# EAGLE design lightbulb-clock (EAGLE 9.6.2)
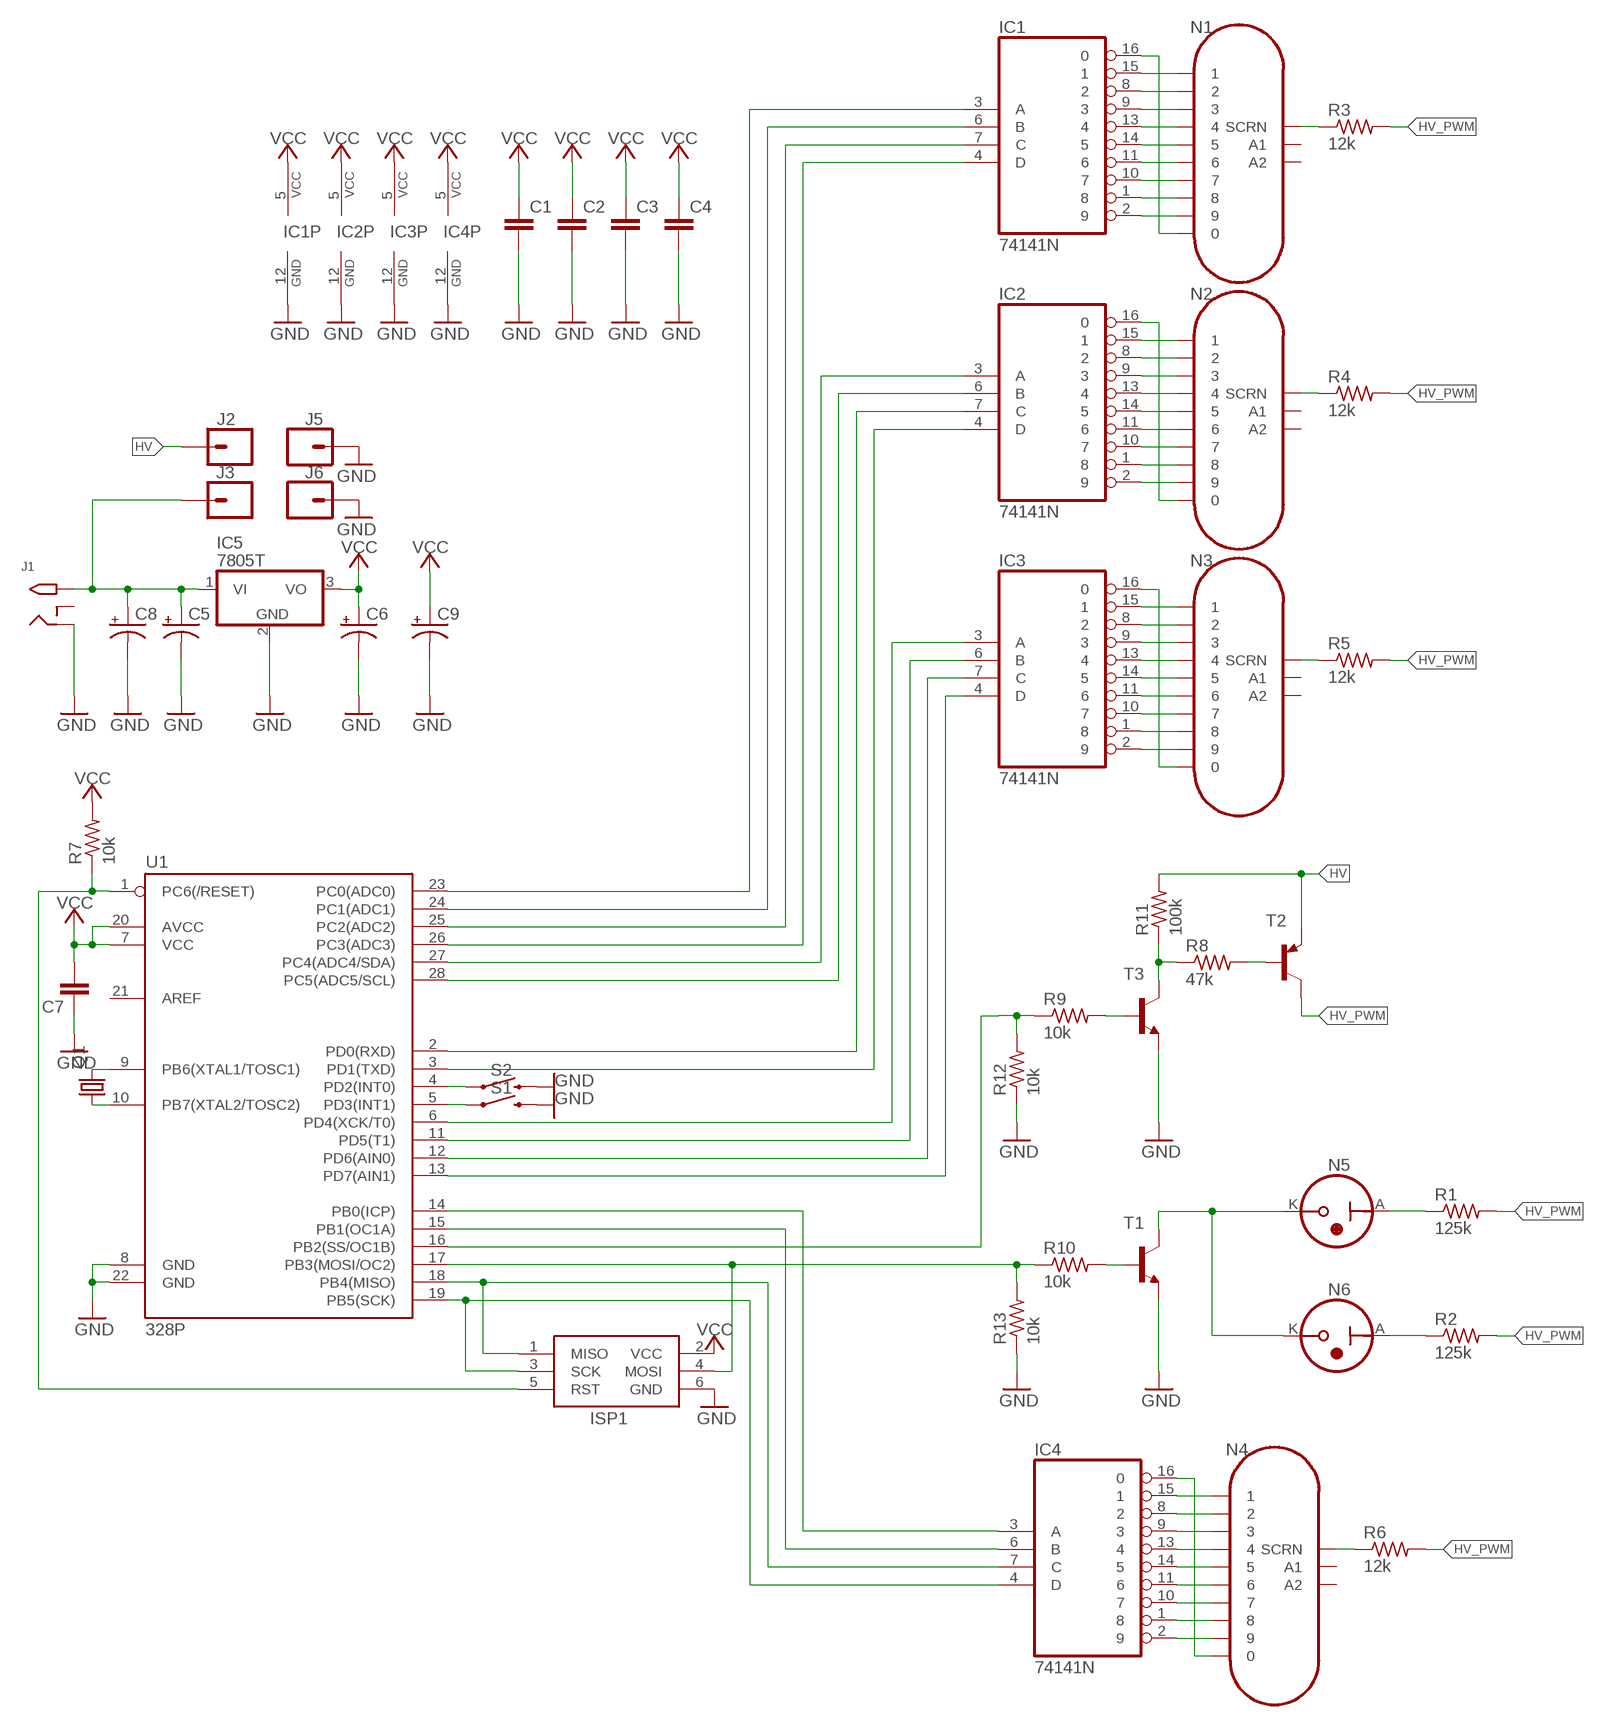
[diagram p0: schematic, sheet 1]

## Parts
C1  C-EU025-024X044  [C025-024X044]
C2  C-EU025-024X044  [C025-024X044]
C3  C-EU025-024X044  [C025-024X044]
C4  C-EU025-024X044  [C025-024X044]
C5  CPOL-USE3.5-8  [E3,5-8]
C6  CPOL-USE3.5-8  [E3,5-8]
C7  C-EU025-024X044  [C025-024X044]
C8  CPOL-USE3.5-8  [E3,5-8]
C9  CPOL-USE3.5-8  [E3,5-8]
IC1  74141N  [DIL16]
IC2  74141N  [DIL16]
IC3  74141N  [DIL16]
IC4  74141N  [DIL16]
IC5  7805T  [TO220H]
ISP1  AVRISP-6  [AVRISP]
J1  2.1MMJACKTHM  [PJ-102A]
J2  CONN_01  [1X01]
J3  CONN_01  [1X01]
J5  CONN_01  [1X01]
J6  CONN_01  [1X01]
N1  IN-4  [IN-4]
N2  IN-4  [IN-4]
N3  IN-4  [IN-4]
N4  IN-4  [IN-4]
N5  INS-1  [INS-1]
N6  INS-1  [INS-1]
Q1  CRYSTALTC26H  [TC26H]
R1  125k  R-US_0204/5  [0204/5]
R2  125k  R-US_0204/5  [0204/5]
R3  12k  R-US_0204/5  [0204/5]
R4  12k  R-US_0204/5  [0204/5]
R5  12k  R-US_0204/5  [0204/5]
R6  12k  R-US_0204/5  [0204/5]
R7  10k  R-US_0204/5  [0204/5]
R8  47k  R-US_0204/5  [0204/5]
R9  10k  R-US_0204/5  [0204/5]
R10  10k  R-US_0204/5  [0204/5]
R11  100k  R-US_0204/5  [0204/5]
R12  10k  R-US_0204/5  [0204/5]
R13  10k  R-US_0204/5  [0204/5]
S1  MOMENTARY-SWITCH-SPST-PTH-6.0MM  [TACTILE_SWITCH_PTH_6.0MM]
S2  MOMENTARY-SWITCH-SPST-PTH-6.0MM  [TACTILE_SWITCH_PTH_6.0MM]
T1  MPSA42-NPN-TO92-EBC  [TO92-EBC]
T2  MPSA92-PNP-TO92-EBC  [TO92-EBC]
T3  MPSA42-NPN-TO92-EBC  [TO92-EBC]
U1  328P  ATMEGA328P_PDIP  [DIP28]

## Nets
GND: C1.2 C2.2 C3.2 C4.2 C5.- C6.- C7.1 C8.- C9.- IC1.12(GND) IC2.12(GND) IC3.12(GND) IC4.12(GND) IC5.2(GND) ISP1.6(GND) J1.RING J5.1 J6.1 R12.1 R13.1 S1.3 S2.3 T1.E T3.E U1.8(GND) U1.22(GND)
HV: J2.1 R11.2 T2.E
HV_PWM [Power]: R1.2 R2.2 R3.2 R4.2 R5.2 R6.2 T2.C
N$1: IC1.1 N1.8
N$2: IC1.2 N1.9
N$3: IC1.8 N1.2
N$4: IC1.9 N1.3
N$5: IC1.10 N1.7
N$6: IC1.11 N1.6
N$7: IC1.13 N1.4
N$8: IC1.14 N1.5
N$9: IC1.15 N1.1
N$10: IC1.16 N1.0
N$11: IC2.1 N2.8
N$12: IC2.2 N2.9
N$13: IC2.8 N2.2
N$14: IC2.9 N2.3
N$15: IC2.10 N2.7
N$16: IC2.11 N2.6
N$17: IC2.13 N2.4
N$18: IC2.14 N2.5
N$19: IC2.15 N2.1
N$20: IC2.16 N2.0
N$21: IC3.1 N3.8
N$22: IC3.2 N3.9
N$23: IC3.8 N3.2
N$24: N1.S(SCRN) R3.1
N$25: IC3.9 N3.3
N$26: N2.S(SCRN) R4.1
N$27: N3.S(SCRN) R5.1
N$28: N4.S(SCRN) R6.1
N$29: N5.A R1.1
N$30: N6.A R2.1
N$31: IC3.10 N3.7
N$32: IC3.11 N3.6
N$33: IC3.13 N3.4
N$34: IC3.14 N3.5
N$35: IC3.15 N3.1
N$36: IC3.16 N3.0
N$37: IC4.1 N4.8
N$38: IC4.2 N4.9
N$39: IC4.8 N4.2
N$40: IC4.9 N4.3
N$41: IC4.10 N4.7
N$42: IC4.11 N4.6
N$43: IC4.13 N4.4
N$44: IC4.14 N4.5
N$45: IC4.15 N4.1
N$46: IC4.16 N4.0
N$47: N5.K N6.K T1.C
N$48: ISP1.4(MOSI) R10.1 R13.2 U1.17(PB3(MOSI/OC2))
N$49: C5.+ C8.+ IC5.1(VI) J1.TIP J3.1
N$50: ISP1.5(RST) R7.1 U1.1(PC6(/RESET))
N$51: IC4.7(C) ISP1.1(MISO) U1.18(PB4(MISO))
N$52: IC4.4(D) ISP1.3(SCK) U1.19(PB5(SCK))
N$53: R8.2 T2.B
N$54: IC3.4(D) U1.13(PD7(AIN1))
N$55: IC4.6(B) U1.15(PB1(OC1A))
N$56: R8.1 R11.1 T3.C
N$57: R9.2 T3.B
N$58: R9.1 R12.2 U1.16(PB2(SS/OC1B))
N$59: R10.2 T1.B
N$60: IC4.3(A) U1.14(PB0(ICP))
N$61: IC3.7(C) U1.12(PD6(AIN0))
N$62: IC3.6(B) U1.11(PD5(T1))
N$63: IC3.3(A) U1.6(PD4(XCK/T0))
N$64: IC2.4(D) U1.3(PD1(TXD))
N$65: IC2.7(C) U1.2(PD0(RXD))
N$66: IC2.6(B) U1.28(PC5(ADC5/SCL))
N$67: S2.1 U1.4(PD2(INT0))
N$68: Q1.2 U1.9(PB6(XTAL1/TOSC1))
N$69: Q1.1 U1.10(PB7(XTAL2/TOSC2))
N$70: S1.1 U1.5(PD3(INT1))
N$71: IC2.3(A) U1.27(PC4(ADC4/SDA))
N$72: IC1.4(D) U1.26(PC3(ADC3))
N$73: IC1.7(C) U1.25(PC2(ADC2))
N$74: IC1.6(B) U1.24(PC1(ADC1))
N$75: IC1.3(A) U1.23(PC0(ADC0))
VCC: C1.1 C2.1 C3.1 C4.1 C6.+ C7.2 C9.+ IC1.5(VCC) IC2.5(VCC) IC3.5(VCC) IC4.5(VCC) IC5.3(VO) ISP1.2(VCC) R7.2 U1.7(VCC) U1.20(AVCC)
Unconnected: J1.RING_SW N1.A1 N1.A2 N2.A1 N2.A2 N3.A1 N3.A2 N4.A1 N4.A2 U1.21(AREF)

## Library data of the parts
C1-C4 C7 = rcl:C-EU: CAPACITOR, European symbol; SPICEPREFIX: C
C5 C6 C8 C9 = rcl:CPOL-US: POLARIZED CAPACITOR, American symbol; SPICEPREFIX: C
IC1-IC4 = 74xx-us:74*141: BCD to decimal DECODER/DRIVER
IC5 = adafruit:78*: Positive VOLTAGE REGULATOR Added bigger pads to the TO-92 package
ISP1 = adafruit:AVRISP: AVR ISP HEADER Standard 6 pin header for AVR programming
J1 = adafruit:2.1MMJACK: 2.1mm x 5.5mm THM DC jack with internal switch. Digikey part #PJ-102A, 4UCON part #05537 2.1mm x 5.5mm SMT DC jack with internal switch. Digikey part #PJ-002A-SMT, 4UCON part #03267 By microbuilder.eu & adafruit.com
J2 J3 J5 J6 = SparkFun-Connectors:CONN_01: Single connection point. Often used as Generic Header-pin footprint for 0.1 inch spaced/style header connections On any of the 0.1 inch spaced packages, you can populate with these: Break Away Headers - Straight <https://www.sparkfun.com/products/116> (PRT-00116) Break Away Male Headers - Right Angle <https://www.sparkfun.com/products/553> (PRT-00553) Female Headers <https://www.sparkfun.com/products/115> (PRT-00115) Break Away Headers - Machine Pin <https://www.sparkfun.com/products/117> (PRT-00117) Break Away Female Headers - Swiss Machine Pin <https://www.sparkfun.com/products/743> (PRT-00743) This device is also useful as a general connection point to wire up your design to another part of your project. Our various solder wires solder well into these plated through hole pads. Hook-Up Wire - Assortment (Stranded, 22 AWG) <https://www.sparkfun.com/products/11375> (PRT-11375) Hook-Up Wire - Assortment (Solid Core, 22 AWG) <https://www.sparkfun.com/products/11367> (PRT-11367) View the entire wire category on our website here <https://www.sparkfun.com/categories/141> Special notes: SMTSO-256-ET is a "flush mount" nut for a 4-40 screw. We mostly use this on specialty testbeds; it is a nice way to connect hardware to your PCB at an adjustable hieght. Also note, the SNAP packages are for using a snappable style connector. We sell a baggie of snaps and they are also used on two LilyPad designs: Snap Assortment - 30 pack (male and female) <https://www.sparkfun.com/products/11347> (DEV-11347) LilyPad Arduino SimpleSnap <https://www.sparkfun.com/products/10941> (DEV-10941) LilyPad SimpleSnap Protoboard <https://www.sparkfun.com/products/10940> (DEV-10940)
N1-N4 = russian-nixies:IN-4: IN-4: large numeric topview nixie tube
N5 N6 = russian-nixies:INS-1
Q1 = adafruit:CRYSTAL: CRYSTAL; OC_FARNELL: unknown; OC_NEWARK: unknown
R1-R13 = rcl:R-US_: RESISTOR, American symbol; SPICEPREFIX: R
S1 S2 = SparkFun-Switches:MOMENTARY-SWITCH-SPST: Momentary Switch (Pushbutton) - SPST Normally-open (NO) SPST momentary switches (buttons, pushbuttons). Variants PTH-12MM - 12mm square, through-hole Momentary Pushbutton Switch - 12mm Square <https://www.sparkfun.com/products/9190> (COM-09190) PTH-6.0MM, PTH-6.0MM-KIT - 6.0mm square, through-hole Mini Pushbutton Switch <https://www.sparkfun.com/products/97> (COM-00097) KIT package intended for soldering kit's - only one side of pads' copper is exposed. PTH-RIGHT-ANGLE-KIT - Right-angle, through-hole Right Angle Tactile Button <https://www.sparkfun.com/products/10791> - Used on SparkFun BigTime Watch Kit <https://www.sparkfun.com/products/11734> SMD-12MM - 12mm square, surface-mount Tactile Button - SMD (12mm) <https://www.sparkfun.com/products/12993> (COM-12993) Used on SparkFun PicoBoard <https://www.sparkfun.com/products/11888> SMD-4.5MM - 4.5mm Square Trackball Switch Used on SparkFun Blackberry Trackballer Breakout <https://www.sparkfun.com/products/13169> SMD-4.6MMX2.8MM - 4.60mm x 2.80mm, surface mount Used on SparkFun SAMD21 Mini Breakout <https://www.sparkfun.com/products/13664> SMD-5.2MM, SMD-5.2-REDUNDANT - 5.2mm square, surface-mount Mini Pushbutton Switch - SMD <https://www.sparkfun.com/products/8720> (COM-08720) Used on Arduino Pro Mini <https://www.sparkfun.com/products/11114> REDUNDANT package connects both switch circuits together SMD-6.0X3.5MM - 6.0 x 3.5mm, surface mount Momentary Reset Switch SMD <https://www.sparkfun.com/products/8229> (COM-08229) SMD-6.2MM-TALL - 6.2mm square, surface mount Tactile Button - SMD (6mm) <https://www.sparkfun.com/products/12992> Used on SparkFun Digital Sandbox <https://www.sparkfun.com/products/12651> SMD-RIGHT-ANGLE - Right-angle, surface mount Used on SparkFun Block for Intel® Edison - Arduino <https://www.sparkfun.com/products/13036>; PROD_ID: SWCH-08441; SF_SKU: COM-00097
T1 T3 = transistor:*-NPN-: NPN Transistror BF959 corrected 2008.03.06
T2 = transistor:*-PNP-: PNP Transistror
U1 = SparkFun-IC-Microcontroller:ATMEGA328P_PDIP: Atmel 328P Through hole ATMEGA328P uC used in the Arduino 32kb flash, 1k EEPROM, 2k SRAM Datasheet <http://www.sparkfun.com/datasheets/Components/SMD/ATMega328.pdf> SparkFun Products Storefront component: AVR 28 Pin 20MHz 32K 6A/D - ATMega328P <https://www.sparkfun.com/products/9061> (COM-09061) SparkFun Simon Says - Through-Hole Soldering Kit <https://www.sparkfun.com/products/10547> (KIT-10547) SparkFun Learn to Solder - Simon Says <https://www.sparkfun.com/products/13708> (KIT-13708) SparkFun BigTime Watch Kit <https://www.sparkfun.com/products/11734> (KIT-11734) SparkFun ClockIt <https://www.sparkfun.com/products/10930> (KIT-10930) SparkFun Serial Enabled LCD Kit <https://www.sparkfun.com/products/10097> (LCD-10097) SparkFun Simon Tilts - Through Hole Soldering Kit <https://www.sparkfun.com/products/12634> (KIT-12634) SparkFun Frequency Counter Kit <https://www.sparkfun.com/products/10140> (KIT-10140) FabFM Radio Kit <https://www.sparkfun.com/products/11043> (KIT-11043) SparkFun Binary Blaster Kit <https://www.sparkfun.com/products/12037> (KIT-12037) SparkFun Metro-Gnome <https://www.sparkfun.com/products/9236> (KIT-09236) ATmega328 with Arduino Optiboot (Uno) <https://www.sparkfun.com/products/10524> (DEV-10524); PROD_ID: IC-09136

## Net classes
1 Power: width 0.254 mm, clearance 0.203 mm

## Board
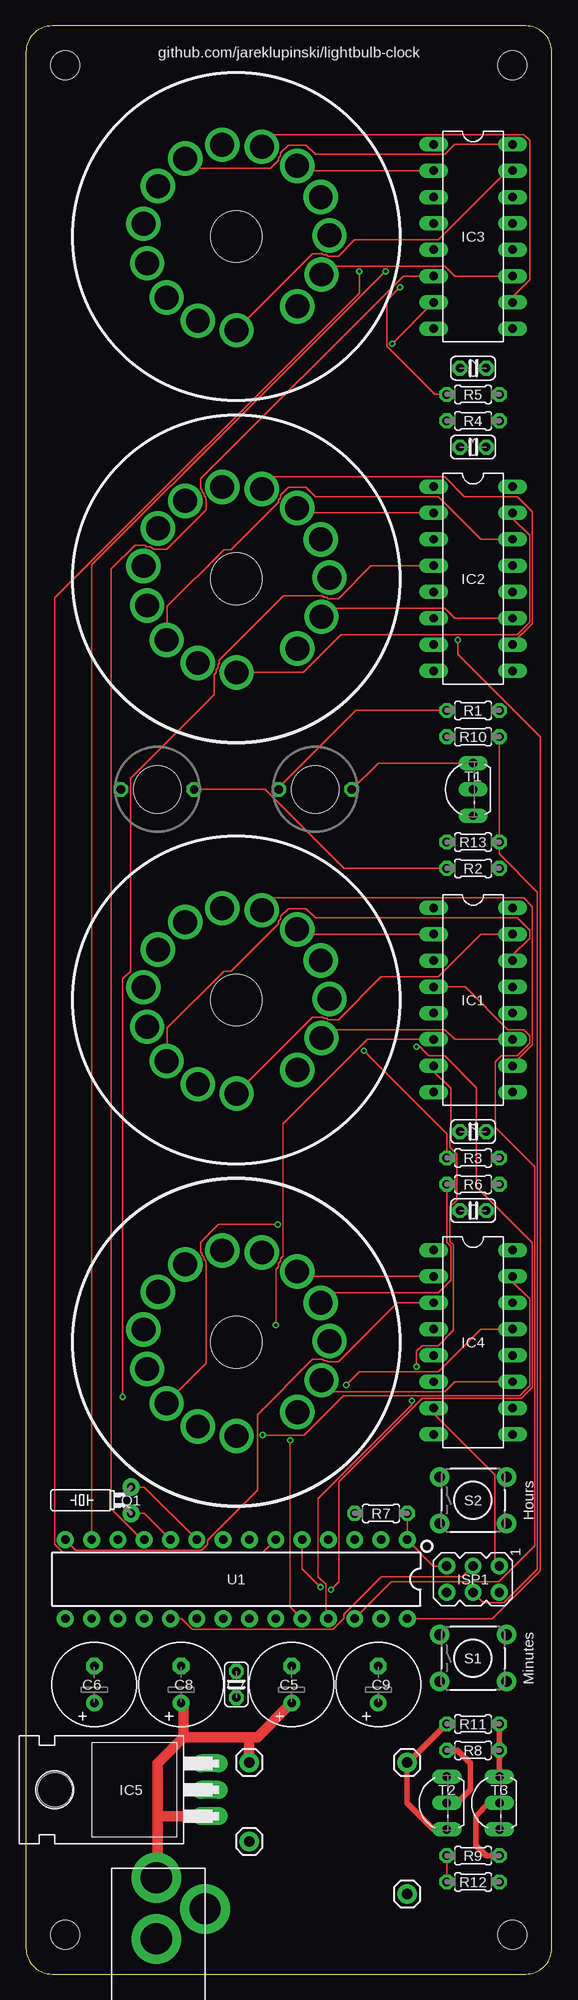
[diagram p1: board, top side]
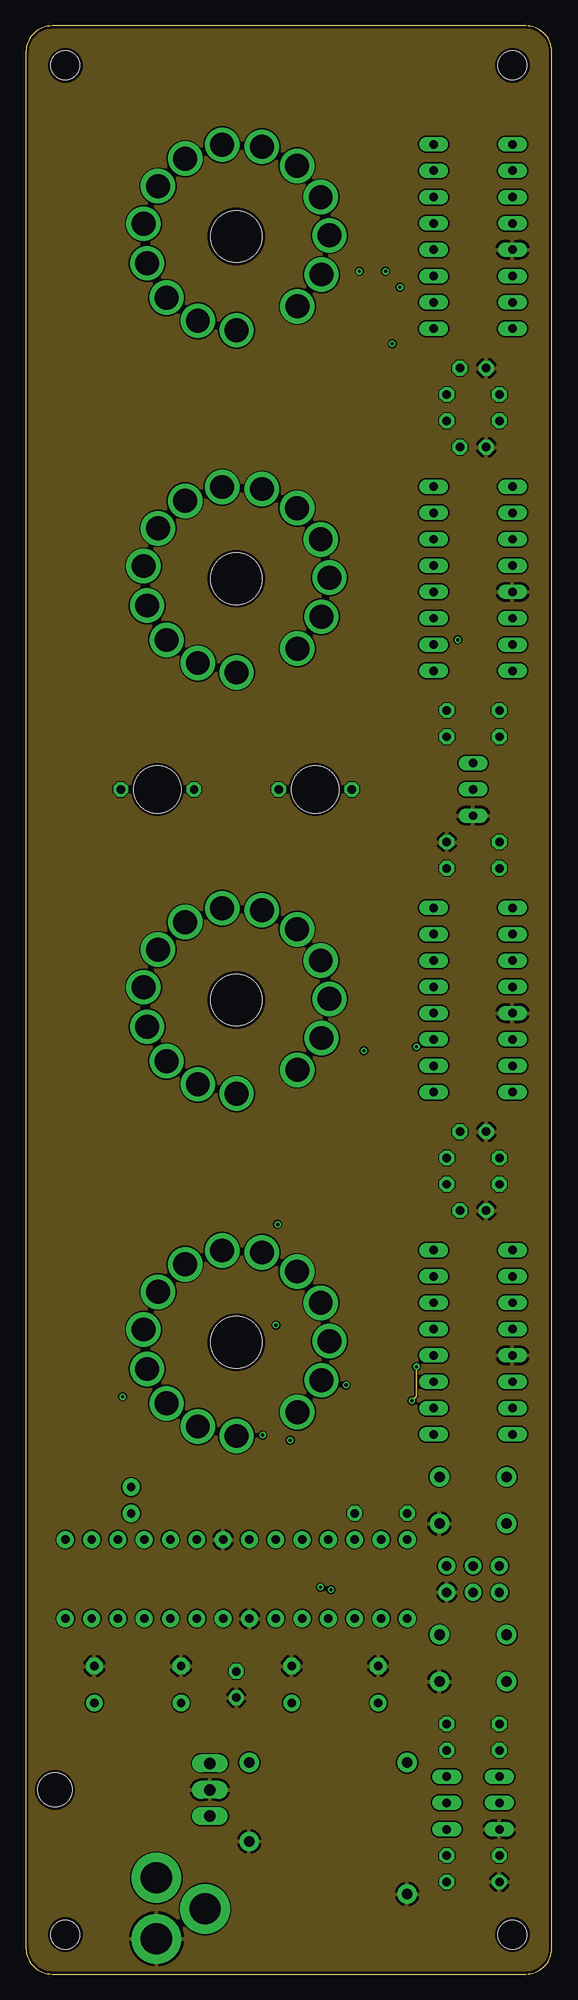
[diagram p2: board, inner layer Route2]
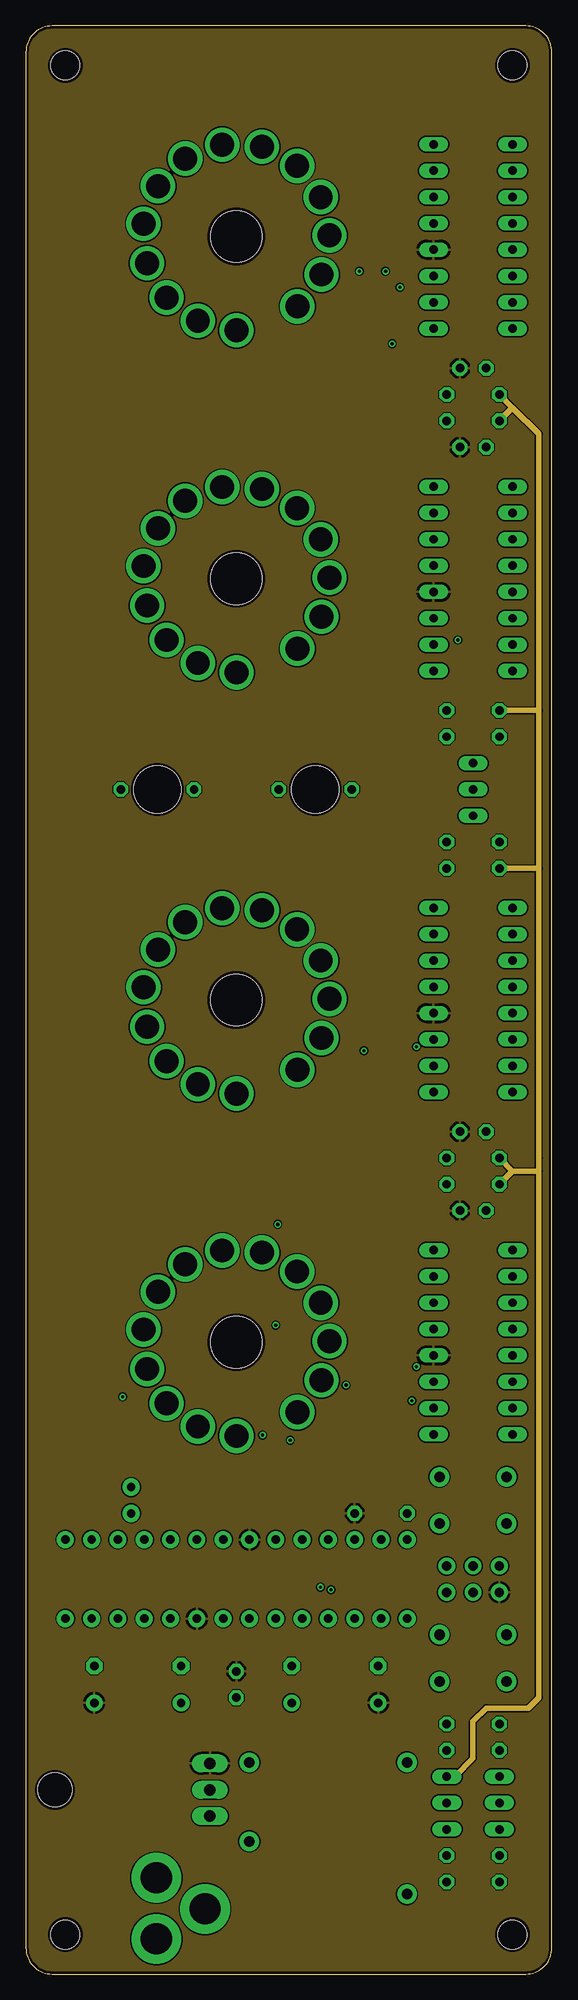
[diagram p3: board, inner layer Route15]
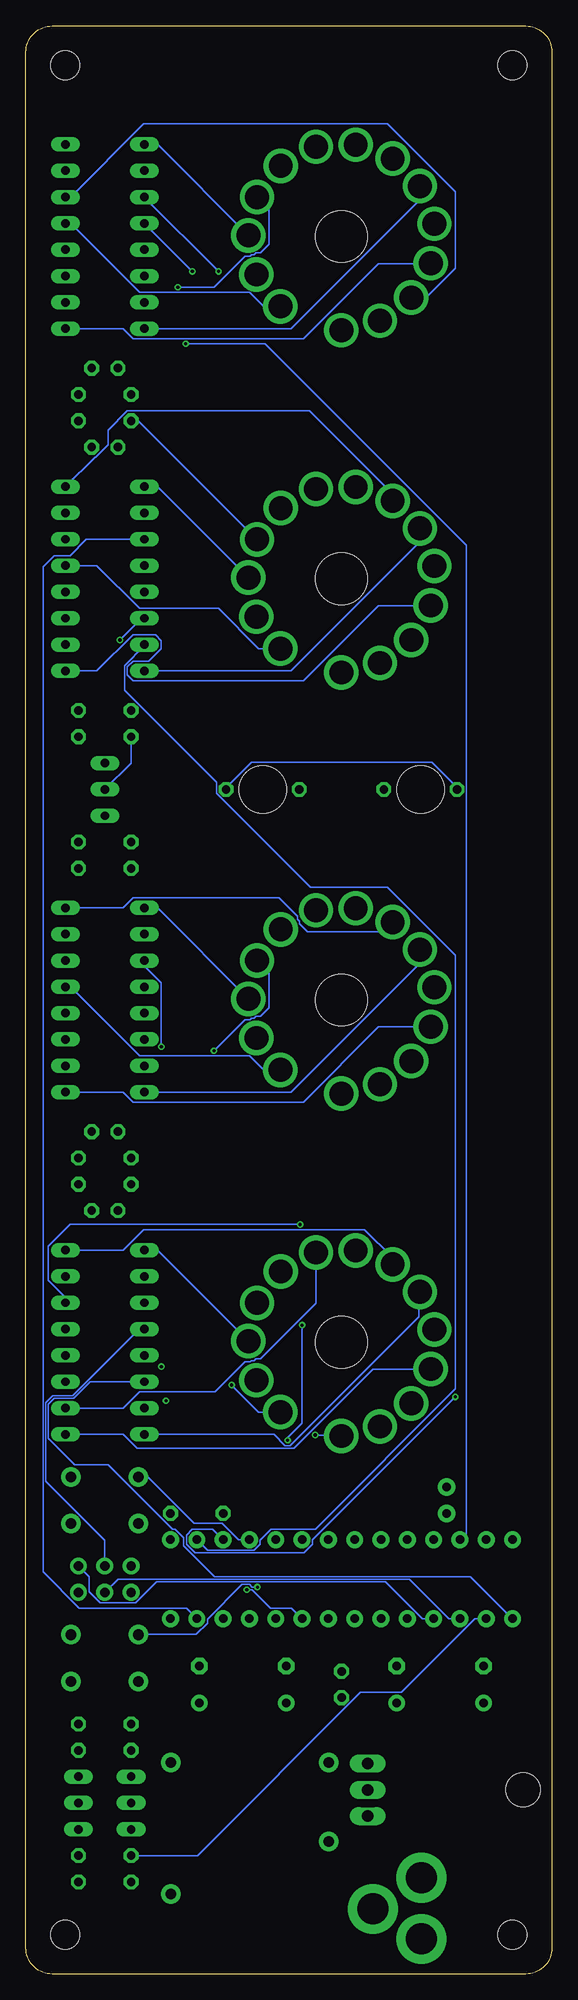
[diagram p4: board, bottom side, seen from below]

Size 50.8 x 187.96 mm. Coordinates in mm from the lower left corner, seen from the top.
Outline: 2.54,0 48.26,0 arc90 50.8,2.54 50.8,185.42 arc90 48.26,187.96 2.54,187.96 arc90 0,185.42 0,2.54 arc90 2.54,0
Copper layers (1*2*15*16): Top 0.035mm / dielectric 0.23mm / Route2 0.035mm / dielectric 0.93mm / Route15 0.035mm / dielectric 0.23mm / Bottom 0.035mm
Design rules "MF_Standard_4_Layer *": minimum track width 5mil, minimum drill 12mil, track to track 5mil, track to pad 5mil, pad to pad 5mil, via to via 5mil, smd to smd 0mil, copper to edge 10mil, drill to drill 10mil, minimum pad ring 12mil, minimum via ring 6mil, stop-mask expansion 2mil, vias tented up to drill 25mil, thermal gap 10mil
Holes 2.79 mm at 46.99,184.15 3.81,184.15 3.81,3.81 46.99,3.81

### Footprints (pad centres in the part's own frame; a part is rotated, then mirrored left to right if it is on the bottom)
C025-024X044 = drill 0.813 octagon: 1 -1.27,0; 2 1.27,0
E3,5-8 = drill 0.813 pad 1.6: + -1.778,0 | drill 0.813 pad 1.6 octagon: - 1.778,0
DIL16 = drill 0.813 long: 1 -8.89,-3.81; 2 -6.35,-3.81; 3 -3.81,-3.81; 4 -1.27,-3.81; 5 1.27,-3.81; 6 3.81,-3.81; 7 6.35,-3.81; 8 8.89,-3.81; 9 8.89,3.81; 10 6.35,3.81; 11 3.81,3.81; 12 1.27,3.81; 13 -1.27,3.81; 14 -3.81,3.81; 15 -6.35,3.81; 16 -8.89,3.81
TO220H = drill 1.118 long: 1 -2.54,-10.16; 2 0,-10.16; 3 2.54,-10.16 | hole 3.302: 0,4.826
AVRISP = drill 0.9 pad 1.626: 1 -1.27,2.54; 2 1.27,2.54; 3 -1.27,0; 4 1.27,0; 5 -1.27,-2.54; 6 1.27,-2.54
PJ-102A = drill 3 pad 4.8: RING 0.1,-3.39; RING_SW -4.6,-6.29; TIP 0.1,-9.29
1X01 = drill 1.016 pad 1.88: 1 0,0
IN-4 = drill 2.3 pad 3.2: 0 -4.939,7.517; 1 0.021,-9.038; 2 -7.562,4.859; 3 -8.616,-2.583; 4 5.9,-6.738; 5 -6.738,-5.9; 6 8.221,-3.669; 7 2.473,8.656; 8 8.995,0.112; 9 5.868,6.819; A1 -3.712,-8.13; A2 -8.959,1.229; NC -1.369,8.851; S 8.157,3.804 | hole 5: 0,0
INS-1 = drill 0.8 octagon: A -3.535,0; K 3.535,0 | hole 4.572: 0,0
TC26H = drill 0.813 pad 1.676: 1 -1.27,0; 2 1.27,0
0204/5 = drill 0.813 octagon: 1 -2.54,0; 2 2.54,0
TACTILE_SWITCH_PTH_6.0MM = drill 1.016 pad 1.88: 1 -3.251,2.261; 2 3.251,2.261; 3 -3.251,-2.261; 4 3.251,-2.261
TO92-EBC = drill 0.813 long: B 0,-1.27; C 2.54,-1.27; E -2.54,-1.27
DIP28 = drill 0.813 pad 1.626: 1 -16.51,-3.81; 2 -13.97,-3.81; 3 -11.43,-3.81; 4 -8.89,-3.81; 5 -6.35,-3.81; 6 -3.81,-3.81; 7 -1.27,-3.81; 8 1.27,-3.81; 9 3.81,-3.81; 10 6.35,-3.81; 11 8.89,-3.81; 12 11.43,-3.81; 13 13.97,-3.81; 14 16.51,-3.81; 15 16.51,3.81; 16 13.97,3.81; 17 11.43,3.81; 18 8.89,3.81; 19 6.35,3.81; 20 3.81,3.81; 21 1.27,3.81; 22 -1.27,3.81; 23 -3.81,3.81; 24 -6.35,3.81; 25 -8.89,3.81; 26 -11.43,3.81; 27 -13.97,3.81; 28 -16.51,3.81

### Placement (x,y rotation side)
C1  43.18,73.66 0 top
C2  43.18,154.94 0 top
C3  43.18,147.32 0 top
C4  43.18,81.28 0 top
C5  25.65,27.94 90 top
C6  6.6,27.94 90 top
C7  20.32,27.94 90 top
C8  14.99,27.94 90 top
C9  34.04,27.94 90 top
IC1  43.18,93.98 270 top
IC2  43.18,134.62 270 top
IC3  43.18,167.64 270 top
IC4  43.18,60.96 270 top
IC5  7.62,17.78 90 top
ISP1  43.18,38.1 270 top
J1  12.7,0 180 top
J2  36.81,20.42 0 top
J3  21.57,20.42 0 top
J5  36.81,7.72 0 top
J6  21.57,12.8 0 top
N1  20.32,93.98 0 top
N2  20.32,134.62 0 top
N3  20.32,167.64 0 top
N4  20.32,60.96 0 top
N5  27.94,114.3 0 top
N6  12.7,114.3 180 top
Q1  10.16,45.72 90 top
R1  43.18,121.92 0 top
R2  43.18,106.68 0 top
R3  43.18,78.74 0 top
R4  43.18,149.86 0 top
R5  43.18,152.4 0 top
R6  43.18,76.2 0 top
R7  34.29,44.45 180 top
R8  43.18,21.59 180 top
R9  43.18,11.43 0 top
R10  43.18,119.38 180 top
R11  43.18,24.13 180 top
R12  43.18,8.89 180 top
R13  43.18,109.22 0 top
S1  43.18,30.48 0 top
S2  43.18,45.72 0 top
T1  41.91,114.3 90 top
T2  39.37,16.51 90 top
T3  44.45,16.51 90 top
U1  20.32,38.1 180 top

### Tracks (layer width: path | path; a pad name or v marks a point on that pad's centre or on a via)
GND
  pour Route2 (isolate 0.13): 50.8,0 50.8,187.96 0,187.96 0,0
HV
  Top 0.508: R11.2 36.93,20.42 J2.1 36.81,16.53 39.37,13.97 T2.E
HV_PWM
  Route15 0.508: 49.53,77.47 49.53,78.74 49.53,106.68 | 49.53,106.68 49.53,121.92 | 49.53,121.92 49.53,148.59 46.99,151.13 | 46.99,151.13 R5.2 | R4.2 46.99,151.13 | R1.2 49.53,121.92 | R2.2 49.53,106.68 | R3.2 46.99,77.47 | 46.99,77.47 49.53,77.47 | R6.2 46.99,77.47 | T2.C 41.4,19.05 43.18,20.83 43.18,24.38 44.45,25.65 48.51,25.65 49.53,26.67 49.53,77.47
N$1
  Bottom 0.127: IC1.1 38.1,102.87 29.34,94.11 N1.8
N$2
  Top 0.127: IC1.2 26.67,100.33 26.23,100.78 N1.9
N$3
  Bottom 0.127: IC1.8 25.21,85.09 12.76,97.54 12.76,98.81 N1.2
N$4
  Bottom 0.127: IC1.9 41.4,85.09 40.45,84.14 24,84.14 16.76,91.38 11.75,91.38 N1.3
N$5
  Top 0.127: IC1.10 46.99,87.76 48.9,89.66 48.9,103 48.07,103.82 23.94,103.82 22.8,102.68 N1.7
N$6
  Top 0.127: IC1.11 41.4,90.17 40.45,91.12 29.34,91.12 28.57,90.36 N1.6
N$7
  Bottom 0.127: IC1.13 46.48,95.25 39.81,88.58 29.21,88.58 27.88,87.25 N1.4
N$8
  Top 0.127: IC1.14 46.99,98.3 48.64,99.95 48.64,100.71 47.43,101.92 27.94,101.92 27.05,102.81 25.34,102.81 24.57,102.04 24.57,101.79 24.38,101.6 24.38,101.35 19.81,96.77 19.11,96.77 13.65,91.31 13.65,88.2 13.59,88.14 N1.5
N$9
  Top 0.127: IC1.15 43.94,100.33 39.81,96.2 34.29,96.2 30.16,92.08 29.15,92.08 29.02,92.2 28.77,92.2 28.64,92.33 27.69,92.33 20.32,84.96 N1.1
N$10
  Bottom 0.127: IC1.16 41.4,102.87 40.45,103.82 26.35,103.82 24.57,102.04 24.57,101.79 24.38,101.6 24.38,101.35 23.62,100.58 16.32,100.58 15.43,101.47 N1.0
N$11
  Bottom 0.127: IC2.1 38.1,143.51 29.34,134.75 N2.8
N$12
  Top 0.127: IC2.2 26.67,140.97 26.23,141.41 N2.9
N$13
  Bottom 0.127: IC2.8 25.21,125.73 12.76,138.18 12.76,139.45 N2.2
N$14
  Bottom 0.127: IC2.9 43.94,125.73 40.45,129.22 38.29,129.22 37.72,128.65 37.72,127.89 38.92,126.68 40.45,126.68 41.02,126.11 41.02,125.35 40.45,124.78 24,124.78 16.76,132.02 11.75,132.02 N2.3
N$15
  Top 0.127: IC2.10 46.99,128.4 48.9,130.3 48.9,141.1 47.43,142.56 42.35,142.56 40.45,144.46 23.94,144.46 22.8,143.32 N2.7
N$16
  Top 0.127: IC2.11 41.4,130.81 40.45,131.76 29.34,131.76 28.57,131 N2.6
N$17
  Bottom 0.127: IC2.13 43.94,135.89 39.81,131.76 32.19,131.76 28.32,127.89 N2.4
N$18
  Top 0.127: IC2.14 43.94,138.43 39.81,142.56 27.94,142.56 27.05,143.45 25.34,143.45 24.57,142.69 24.57,142.43 24.38,142.24 24.38,141.99 19.81,137.41 19.11,137.41 13.65,131.95 13.65,128.84 13.59,128.78 N2.5
N$19
  Top 0.127: IC2.15 46.99,140.46 48.64,138.81 48.64,130.43 47.43,129.22 30.42,129.22 26.8,125.6 20.38,125.6 N2.1
N$20
  Bottom 0.127: IC2.16 44.13,146.37 44.07,146.37 42.86,147.57 42.86,148.97 41.02,150.81 23.43,150.81 15.43,142.81 15.43,142.18 N2.0
N$21
  Bottom 0.127: IC3.1 38.1,176.53 29.34,167.77 N3.8
N$22
  Top 0.127: IC3.2 26.67,173.99 26.23,174.44 N3.9
N$23
  Bottom 0.127: IC3.8 25.21,158.75 12.76,171.2 12.76,172.47 N3.2
N$24  (via drill 0.3)
  Top 0.127: R3.1 40.64,81.09 v32.64,89.09
  Bottom 0.127: v32.64,89.09 29.65,92.08 29.15,92.08 29.02,92.2 28.77,92.2 28.57,92.39 28.13,92.39 27.3,93.22 27.3,96.58 28.45,97.73 N1.S
N$25
  Bottom 0.127: IC3.9 41.4,158.75 40.45,157.8 24,157.8 16.76,165.04 11.75,165.04 N3.3
N$26
  Bottom 0.127: R4.1 39.94,149.86 28.51,138.43 N2.S
N$27  (via drill 0.3)
  Top 0.127: R5.1 39.5,152.4 34.86,157.04 34.86,161.48 v36.13,162.75
  Bottom 0.127: v36.13,162.75 32.64,162.75 29.65,165.74 29.15,165.74 29.02,165.86 28.77,165.86 28.57,166.05 28.13,166.05 27.3,166.88 27.3,170.24 28.45,171.39 N3.S
N$28
  Top 0.127: R6.1 40.64,70.61 41.02,70.23 41.02,66.93 39.81,65.72 29.46,65.72 28.51,64.77 N4.S
N$29
  Top 0.127: R1.1 31.88,121.92 24.45,114.49 24.45,114.3 N5.A
N$30
  Top 0.127: R2.1 30.73,106.68 23.11,114.3 16.26,114.3 N6.A
N$31
  Top 0.127: IC3.10 46.99,161.8 48.64,163.45 48.64,176.91 48.07,177.48 23.94,177.48 22.8,176.34 N3.7
N$32
  Top 0.127: IC3.11 41.4,163.83 40.45,164.78 29.34,164.78 28.57,164.02 N3.6
N$33
  Bottom 0.127: IC3.13 46.48,168.91 39.81,162.24 29.21,162.24 27.88,160.91 N3.4
N$34
  Bottom 0.127: IC3.14 46.48,171.45 39.43,178.5 15.88,178.5 9.34,171.96 9.34,164.59 12.13,161.8 13.53,161.8 N3.5
N$35
  Top 0.127: IC3.15 46.48,173.99 39.81,167.32 31.75,167.32 30.16,165.74 29.15,165.74 29.02,165.86 28.77,165.86 28.64,165.99 27.69,165.99 20.32,158.62 N3.1
N$36
  Top 0.127: IC3.16 41.4,176.53 40.45,175.58 27.94,175.58 27.05,176.47 25.34,176.47 24.57,175.7 24.57,175.45 24.38,175.26 24.38,175.01 23.62,174.24 16.32,174.24 15.43,175.13 N3.0
N$37
  Bottom 0.127: IC4.1 38.1,69.85 29.34,61.09 N4.8
N$38
  Top 0.127: IC4.2 26.67,67.31 26.23,67.75 N4.9
N$39
  Bottom 0.127: IC4.8 26.86,52.07 25.78,50.99 25.27,50.99 12.83,63.44 12.83,65.72 12.76,65.79 N4.2
N$40
  Bottom 0.127: IC4.9 41.4,52.07 40.07,50.74 24.89,50.74 17.27,58.36 11.75,58.36 N4.3
N$41
  Bottom 0.127: IC4.10 41.4,54.61 39.81,56.2 32.51,56.2 29.65,59.05 29.15,59.05 29.02,59.18 28.77,59.18 28.57,59.37 28.13,59.37 22.8,64.71 22.8,69.6 N4.7
N$42
  Top 0.127: IC4.11 41.4,57.15 40.45,56.2 29.65,56.2 28.57,57.28 N4.6
N$43  (via drill 0.3)
  Top 0.127: IC4.13 43.94,62.23 39.81,58.1 32.19,58.1 v30.92,56.83
  Bottom 0.127: v30.92,56.83 28.32,54.23 N4.4
N$44  (via drill 0.3)
  Top 0.127: v24.32,72.33 18.61,72.33 16.89,70.61 16.89,69.66 17.02,69.53 17.02,69.34 17.21,69.15 17.21,68.96 17.34,68.83 17.34,68.71 17.4,68.64 17.4,58.93 13.59,55.12 N4.5
  Bottom 0.127: IC4.14 46.99,65.28 48.64,66.93 48.64,70.23 46.55,72.33 v24.32,72.33
N$45  (via drill 0.3)
  Top 0.127: IC4.15 46.99,66.8 48.64,65.15 48.64,56.77 47.69,55.82 30.67,55.82 26.86,52.01 v22.86,52.01
  Bottom 0.127: v22.86,52.01 20.45,52.01 20.38,51.94 N4.1
N$46
  Bottom 0.127: IC4.16 41.4,69.85 39.43,71.82 18.1,71.82 15.43,69.15 15.43,68.52 N4.0
N$47
  Top 0.127: T1.C 34.04,116.84 31.5,114.3 N5.K
  Bottom 0.127: N6.K 9.21,114.3 9.21,114.49 11.62,116.9 29.02,116.9 31.43,114.49 31.43,114.3 N5.K
N$48
  Top 0.127: R10.1 R13.2 45.72,108.08 49.4,104.39 49.4,39.05 46.16,35.81 44.2,35.81 ISP1.4
  Bottom 0.127: U1.17 9.97,34.29 13.78,38.1 41.91,38.1 ISP1.4
N$49
  Top 1.016: IC5.1 12.7,15.24 | J1.TIP 12.7,9.39 12.7,15.24 | C5.+ 22.35,22.86 21.59,22.86 | 21.59,22.86 15.24,22.86 | 15.24,22.86 12.7,20.32 12.7,15.24 | C8.+ 15.24,25.91 15.24,22.86 | J3.1 21.57,22.84 21.59,22.86
N$50
  Top 0.127: R7.1 U1.1 39.37,39.37 ISP1.5
N$51
  Top 0.127: IC4.7 39.37,54.1 45.28,48.2 45.28,39.81 ISP1.1
  Bottom 0.127: U1.18 12.51,34.29 16.07,37.85 38.16,37.85 40.2,35.81 43.62,35.81 44.7,36.89 44.7,38.35 ISP1.1
N$52
  Top 0.127: U1.19 15.05,34.29 16.07,33.27 29.65,33.27 30.73,34.35 30.73,34.73 34.35,38.35 42.16,38.35 ISP1.3
  Bottom 0.127: IC4.4 39.88,62.23 46.29,55.82 48.2,55.82 48.9,55.12 48.9,47.56 43.18,41.85 ISP1.3
N$53
  Top 0.508: T2.B 41.66,16.51 42.93,17.78 42.93,20.32 41.66,21.59 R8.2
N$54  (via drill 0.3)
  Top 0.127: v34.73,164.27 14.03,143.57 13.97,143.57 6.35,135.95 U1.13
  Bottom 0.127: v34.73,164.27 IC3.4
N$55
  Bottom 0.127: IC4.6 44.58,57.15 46.16,55.56 48.07,55.56 48.64,54.99 48.64,51.69 46.1,49.15 42.86,49.15 36.64,42.93 36.39,42.93 35.56,42.1 35.56,41.34 32.58,38.35 7.87,38.35 U1.15
N$56
  Top 0.508: R11.1 R8.1 T3.C
N$57
  Top 0.508: R9.2 44.45,11.43 43.43,12.45 43.43,15.24 44.7,16.51 T3.B
N$58
  Top 0.127: R9.1 R12.2
  Bottom 0.127: U1.16 7.43,34.29 14.54,27.18 18.48,27.18 34.23,11.43 R9.1
N$59
  Bottom 0.127: R10.2 40.64,116.84 T1.B
N$60
  Top 0.127: IC4.3 35.88,64.77 30.16,59.05 29.15,59.05 29.02,59.18 28.77,59.18 28.64,59.31 27.69,59.31 22.35,53.98 22.35,46.67 17.53,41.85 17.53,41.47 16.95,40.89 4.83,40.89 U1.14
N$61  (via drill 0.3)
  Top 0.127: v35.37,157.29 IC3.7
  Bottom 0.127: v35.37,157.29 27.69,157.29 8.26,137.86 8.26,42.55 U1.12
N$62
  Top 0.127: IC3.6 36.45,163.83 16.89,144.27 16.89,143.32 17.02,143.19 17.02,143 17.21,142.81 17.21,142.62 17.34,142.49 17.34,142.37 17.4,142.3 17.4,141.29 13.59,137.48 12.32,137.48 12.06,137.73 11.62,137.73 11.49,137.86 10.54,137.86 8.26,135.57 8.26,44.9 11.24,41.91 U1.11
N$63  (via drill 0.3)
  Top 0.127: v32.19,164.27 32.19,162.18 2.79,132.78 2.79,41.47 3.62,40.64 22.86,40.64 U1.6
  Bottom 0.127: v32.19,164.27 IC3.3
N$64  (via drill 0.3)
  Top 0.127: IC2.4 33.34,135.89 30.16,132.72 29.15,132.72 29.02,132.84 28.77,132.84 28.64,132.97 24.89,132.97 18.67,126.75 18.67,126.43 18.54,126.3 18.54,126.05 18.35,125.86 18.35,125.54 18.16,125.35 18.16,123.44 10.1,115.38 10.1,96.77 9.34,96.01 v9.34,55.69
  Bottom 0.127: v9.34,55.69 23.11,41.91 23.11,41.47 23.94,40.64 34.48,40.64 35.31,41.47 35.31,42.35 34.73,42.93 32.77,42.93 U1.3
N$65
  Bottom 0.127: IC2.7 39.37,128.14 41.27,126.24 41.27,123.89 32.38,115 32.38,113.92 23.3,104.84 15.88,104.84 9.34,98.3 9.34,56.45 22.86,42.93 27.11,42.93 28.19,41.85 28.19,41.47 28.77,40.89 33.27,40.89 U1.2
N$66  (via drill 0.3)
  Top 0.127: v41.72,128.71 41.72,127.32 49.66,119.38 49.66,38.92 45.02,34.29 U1.28
  Bottom 0.127: IC2.6 39.62,130.81 v41.72,128.71
N$67
  Bottom 0.127: U1.4 30.29,41.91 31.88,43.5 34.54,43.5 38.99,47.94 39.88,47.94 S2.1
N$68
  Top 0.152: Q1.2 11.43,46.99 U1.9
N$69
  Top 0.152: Q1.1 11.43,44.45 U1.10
N$70  (via drill 0.3)
  Top 0.127: U1.5 26.67,39.12 v28.45,37.34
  Bottom 0.127: v28.45,37.34 28.96,37.34 29.21,37.59 29.91,37.59 33.27,34.23 33.27,33.85 34.35,32.77 39.88,32.77 S1.1
N$71
  Bottom 0.127: IC2.3 44.96,138.43 46.55,136.84 48.07,136.84 49.15,135.76 49.15,38.8 45.66,35.31 35.31,35.31 U1.27
N$72
  Top 0.127: IC1.4 42.42,95.25 46.55,91.12 48.07,91.12 48.64,90.55 48.64,89.79 47.43,88.58 45.91,88.58 45.34,88.01 45.34,81.72 49.15,77.92 49.15,41.34 45.66,37.85 35.31,37.85 U1.26
N$73  (via drill 0.3)
  Top 0.127: IC1.7 39.37,87.12 41.02,85.47 41.02,81.72 40.96,81.66 40.96,79.76 41.59,79.12 41.59,74.68 40.96,74.04 40.96,70.67 41.27,70.36 41.27,62.1 39.81,60.64 38.29,60.64 37.72,60.07 v37.72,58.61 | v37.27,55.31 37.27,54.93 28.19,45.85 28.19,38.35 28.96,37.59 28.96,34.54 U1.25
  Route2 0.127: v37.72,58.61 37.72,55.75 v37.27,55.31
N$74  (via drill 0.3)
  Top 0.127: IC1.6 32.96,90.17 24.83,82.04 24.83,69.28 24.57,69.03 24.57,68.77 24.38,68.58 24.38,68.26 24.13,68.01 v24.13,62.61 | v25.53,51.5 25.53,35.43 U1.24
  Bottom 0.127: v24.13,62.61 24.13,53.15 25.53,51.75 v25.53,51.5
N$75  (via drill 0.3)
  Top 0.127: v37.72,89.47 38.04,89.47 38.92,88.58 40.45,88.58 43.5,85.53 43.5,75.95 48.9,70.55 48.9,56.64 47.82,55.56 38.29,55.56 30.23,47.5 30.23,37.85 v29.46,37.08
  Bottom 0.127: IC1.3 39.37,97.28 37.72,95.63 v37.72,89.47 | v29.46,37.08 28.96,37.08 27.18,35.31 25.15,35.31 U1.23
VCC
  pour Route15: 50.8,0 50.8,187.96 0,187.96 0,0

### Text on the board
tNames: github.com/jareklupinski/lightbulb-clock | Hours | Minutes